# Altium project Minuterie.PrjPcb
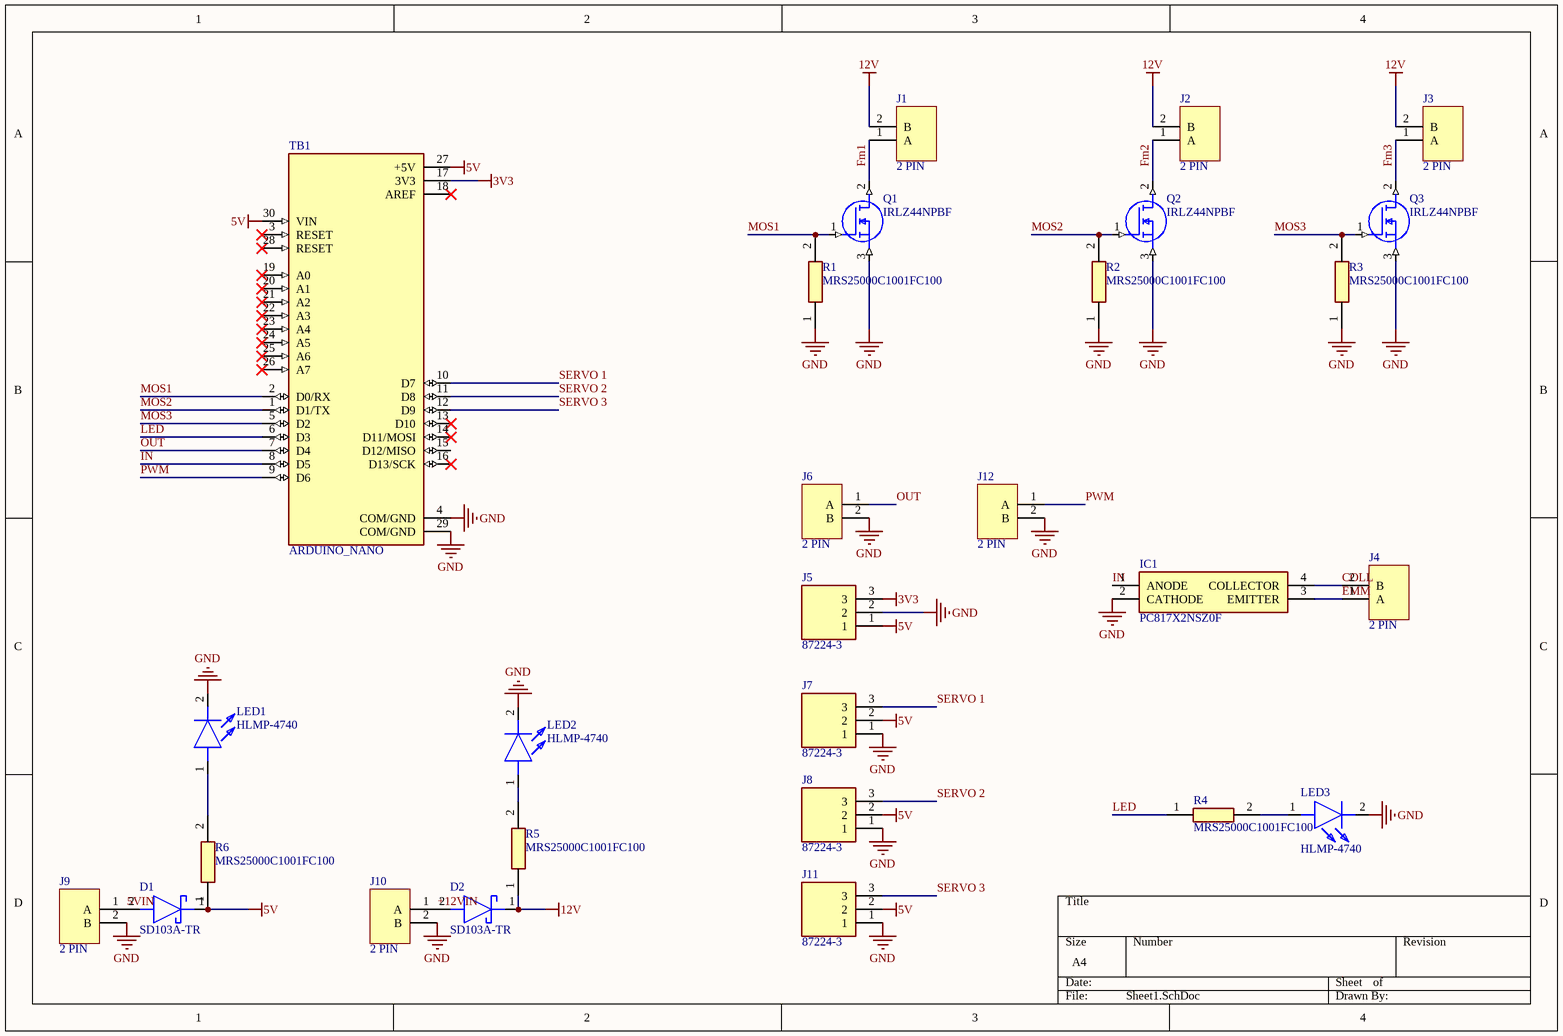
[diagram p0: Sheet1.SchDoc]
1 sheet, 28 parts. Net scope: global (net labels, ports and power ports of the same name join across sheets).
Board file: PCB1.PcbDoc

## Sheet Sheet1.SchDoc
size A4; SheetNumber: 1; SheetTotal: 1

### Parts
D1  SD103A-TR  [DIOAD950W60L350D150]
D2  SD103A-TR  [DIOAD950W60L350D150]
IC1  PC817X2NSZ0F  [DIP762W60P254L458H400Q4N]
J1  2 PIN  [Header 2_PIN]
J2  2 PIN  [Header 2_PIN]
J3  2 PIN  [Header 2_PIN]
J4  2 PIN  [Header 2_PIN]
J5  87224-3  [872243]
J6  2 PIN  [Header 2_PIN]
J7  87224-3  [872243]
J8  87224-3  [872243]
J9  2 PIN  [Header 2_PIN]
J10  2 PIN  [Header 2_PIN]
J11  87224-3  [872243]
J12  2 PIN  [Header 2_PIN]
LED1  HLMP-4740  [HLMP4740]
LED2  HLMP-4740  [HLMP4740]
LED3  HLMP-4740  [HLMP4740]
Q1  IRLZ44NPBF  [TO254P469X1042X1967-3P]
Q2  IRLZ44NPBF  [TO254P469X1042X1967-3P]
Q3  IRLZ44NPBF  [TO254P469X1042X1967-3P]
R1  MRS25000C1001FC100  [RESAD1650W60L650D250]
R2  MRS25000C1001FC100  [RESAD1650W60L650D250]
R3  MRS25000C1001FC100  [RESAD1650W60L650D250]
R4  MRS25000C1001FC100  [RESAD1650W60L650D250]
R5  MRS25000C1001FC100  [RESAD1650W60L650D250]
R6  MRS25000C1001FC100  [RESAD1650W60L650D250]
TB1  ARDUINO_NANO  [SHIELD_ARDUINO_NANO]

### Nets
3V3: J5.3 TB1.17(3V3)
5V: D1.1(K) J5.1 J7.2 J8.2 J11.2 R6.1 TB1.27(+5V) TB1.30(VIN)
12V: D2.1(K) J1.2(B) J2.2(B) J3.2(B) R5.1
GND: IC1.2(CATHODE) J5.2 J6.2(B) J7.1 J8.1 J9.2(B) J10.2(B) J11.1 J12.2(B) LED1.2(K) LED2.2(K) LED3.2(K) Q1.3(S) Q2.3(S) Q3.3(S) R1.1 R2.1 R3.1 TB1.4(COM/GND) TB1.29(COM/GND)
5VIN: D1.2(A) J9.1(A)
+12VIN: D2.2(A) J10.1(A)
COLL: IC1.4(COLLECTOR) J4.2(B)
EMM: IC1.3(EMITTER) J4.1(A)
Fm1: J1.1(A) Q1.2(D)
Fm2: J2.1(A) Q2.2(D)
Fm3: J3.1(A) Q3.2(D)
IN: IC1.1(ANODE) TB1.8(D5)
LED: R4.1 TB1.6(D3)
MOS1: Q1.1(G) R1.2 TB1.2(D0/RX)
MOS2: Q2.1(G) R2.2 TB1.1(D1/TX)
MOS3: Q3.1(G) R3.2 TB1.5(D2)
OUT: J6.1(A) TB1.7(D4)
PWM: J12.1(A) TB1.9(D6)
SERVO 1: J7.3 TB1.10(D7)
SERVO 2: J8.3 TB1.11(D8)
SERVO 3: J11.3 TB1.12(D9)
NetLED1_1: LED1.1(A) R6.2
NetLED2_1: LED2.1(A) R5.2
NetLED3_1: LED3.1(A) R4.2

Not connected (* = marked no-connect by the designer): TB1 3(RESET)* 13(D10)* 14(D11/MOSI)* 15(D12/MISO) 16(D13/SCK)* 18(AREF)* 19(A0)* 20(A1)* 21(A2)* 22(A3)* 23(A4)* 24(A5)* 25(A6)* 26(A7)* 28(RESET)*

### Library data of the parts
D1 D2 = SD103A-TR: Schottky Diode; Manufacturer_Name: Vishay; Datasheet Link: https://componentsearchengine.com/Datasheets/5/SD103A-TR.pdf; Manufacturer_Part_Number: SD103A-TR; Mouser Part Number: 625-SD103A; Mouser Price/Stock: https://www.mouser.co.uk/ProductDetail/Vishay-Semiconductors/SD103A-TR?qs=RwahMLkpD2urFD%2FzZdGOBw%3D%3D; Arrow Part Number: SD103A-TR; Arrow Price/Stock: https://www.arrow.com/en/products/sd103a-tr/vishay?region=nac
IC1 = PC817X2NSZ0F: Integrated Circuit; Manufacturer_Name: Sharp Microelectronics; Datasheet Link: https://datasheet.datasheetarchive.com/originals/distributors/Datasheets_SAMA/458e45842a103a05998fcebbd6f7366e.pdf; Height: 4mm; Manufacturer_Part_Number: PC817X2NSZ0F; Mouser Part Number: N/A; Mouser Price/Stock: https://www.mouser.co.uk/ProductDetail/Sharp-Microelectronics/PC817X2NSZ0F?qs=6kT3pPPHxnU7uYWM8Yy85A%3D%3D
J1-J4 J6 J9 J10 J12 = Connector_2Pin
J5 J7 J8 J11 = 87224-3: Connector; Manufacturer_Name: TE Connectivity; Datasheet Link: https://datasheet.datasheetarchive.com/originals/distributors/Datasheets_SAMA/3b9b08c08f06dc562fe3ba32b60fa864.pdf; Height: 10.3632mm; Manufacturer_Part_Number: 87224-3; Mouser Part Number: 571-872243; Mouser Price/Stock: https://www.mouser.co.uk/ProductDetail/TE-Connectivity/87224-3?qs=VKrXD49J9ErediZOfWku7Q%3D%3D; Arrow Part Number: 87224-3; Arrow Price/Stock: https://www.arrow.com/en/products/87224-3/te-connectivity?region=nac
LED1-LED3 = HLMP-4740: LED; Manufacturer_Name: Avago Technologies; Datasheet Link: https://docs.broadcom.com/docs/AV02-1557EN; Height: 9.19mm; Manufacturer_Part_Number: HLMP-4740; Mouser Part Number: 630-HLMP-4740; Mouser Price/Stock: https://www.mouser.co.uk/ProductDetail/Broadcom-Avago/HLMP-4740?qs=jT9z6tsiFNlbkh2eYMYS%2Fw%3D%3D
Q1-Q3 = IRLZ44NPBF: MOSFET (N-Channel); Manufacturer_Name: Infineon; Datasheet Link: http://www.irf.com/product-info/datasheets/data/irlz44n.pdf; Height: 4.69mm; Manufacturer_Part_Number: IRLZ44NPBF; Mouser Part Number: 942-IRLZ44NPBF; Mouser Price/Stock: https://www.mouser.co.uk/ProductDetail/Infineon-Technologies/IRLZ44NPBF?qs=9%252BKlkBgLFf15OZZk%252BD0ibg%3D%3D; Arrow Part Number: IRLZ44NPBF; Arrow Price/Stock: https://www.arrow.com/en/products/irlz44npbf/infineon-technologies-ag?region=nac
R1-R6 = MRS25000C1001FC100: Resistor; Manufacturer_Name: Vishay; Datasheet Link: http://www.vishay.com/docs/28724/mrs16m25.pdf; Manufacturer_Part_Number: MRS25000C1001FC100; Mouser Part Number: 594-MRS25000C1001FC1; Mouser Price/Stock: https://www.mouser.co.uk/ProductDetail/Vishay-BC-Components/MRS25000C1001FC100?qs=H30XFsNYD%2FEk7X0%2FV%252BraxQ%3D%3D; Arrow Part Number: MRS25000C1001FC100; Arrow Price/Stock: https://www.arrow.com/en/products/mrs25000c1001fc100/vishay
TB1 = ARDUINO_NANO: Small, complete, and breadboard-friendly board based on the ATmega328 (Arduino Nano 3.x); Check_prices: https://www.snapeda.com/parts/Arduino%20Nano/Arduino/view-part/?ref=eda; Value: *; Availability: Not in stock; MP: Arduino Nano; Price: None; Package: Non-Standard Arduino; SnapEDA_Link: https://www.snapeda.com/parts/Arduino%20Nano/Arduino/view-part/?ref=snap; MF: Arduino